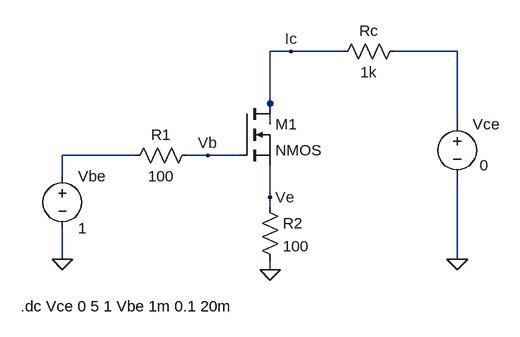
[diagram p0: schematic Aufgabe2.asc]
Aufgabe2.asc, the LTspice schematic file:
Version 4
SHEET 1 1028 680
WIRE 320 -16 288 -16
WIRE 400 -16 320 -16
WIRE 576 -16 480 -16
WIRE 288 64 288 -16
WIRE 288 96 288 64
WIRE 576 96 576 -16
WIRE 80 144 -32 144
WIRE 192 144 160 144
WIRE 240 144 192 144
WIRE -32 176 -32 144
WIRE 288 208 288 160
WIRE 288 224 288 208
WIRE -32 304 -32 256
WIRE 576 304 576 176
WIRE 288 320 288 304
FLAG 288 320 0
FLAG -32 304 0
FLAG 576 304 0
FLAG 320 -16 Ic
FLAG 192 144 Vb
FLAG 288 208 Ve
SYMBOL voltage 576 80 R0
WINDOW 3 35 79 Left 2
WINDOW 123 0 0 Left 0
WINDOW 39 0 0 Left 0
SYMATTR Value 0
SYMATTR InstName Vce
SYMBOL res 496 -32 R90
WINDOW 0 0 56 VBottom 2
WINDOW 3 32 56 VTop 2
SYMATTR InstName Rc
SYMATTR Value 1k
SYMBOL voltage -32 160 R0
WINDOW 123 0 0 Left 0
WINDOW 39 0 0 Left 0
SYMATTR InstName Vbe
SYMATTR Value 1
SYMBOL res 176 128 R90
WINDOW 0 0 56 VBottom 2
WINDOW 3 32 56 VTop 2
SYMATTR InstName R1
SYMATTR Value 100
SYMBOL res 272 208 R0
SYMATTR InstName R2
SYMATTR Value 100
SYMBOL nmos 240 64 R0
SYMATTR InstName M1
TEXT -96 376 Left 2 !.dc Vce 0 5 1 Vbe 1m 0.1 20m

The netlist it stands for:
* Aufgabe2.asc
Vce N001 0 0
Rc N001 Ic 1k
Vbe N002 0 1
R1 Vb N002 100
R2 Ve 0 100
M1 Ic Vb Ve Ve NMOS
.model NMOS NMOS
.model PMOS PMOS
.lib standard.mos
.dc Vce 0 5 1 Vbe 1m 0.1 20m
.backanno
.end